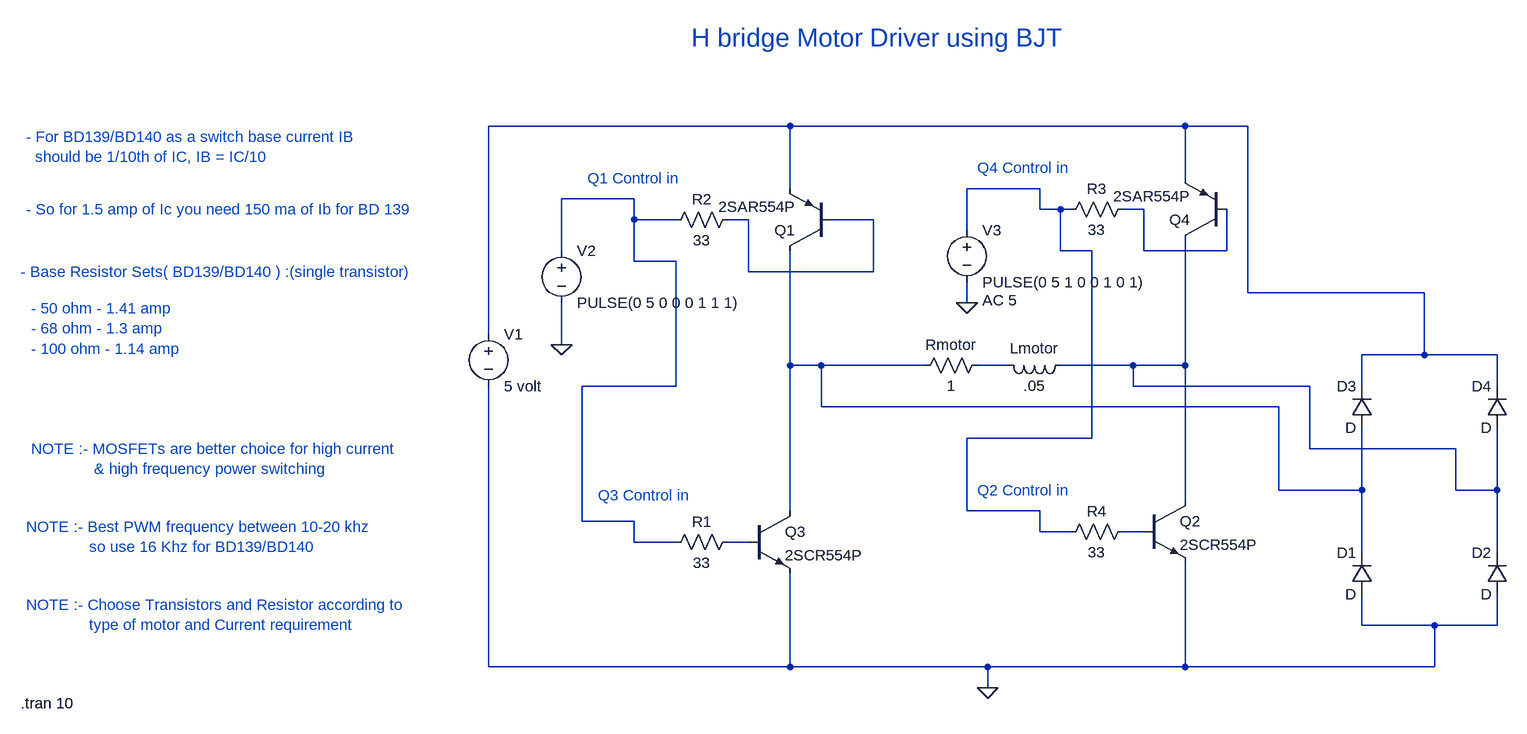
[diagram p0: schematic H Bridge using BJT.asc]
H Bridge using BJT.asc, the LTspice schematic file:
Version 4
SHEET 1 1668 840
WIRE 208 -64 -256 -64
WIRE 816 -64 208 -64
WIRE 912 -64 816 -64
WIRE 816 16 816 -64
WIRE 208 32 208 -64
WIRE 592 32 480 32
WIRE -32 48 -144 48
WIRE 592 64 592 32
WIRE 624 64 592 64
WIRE 640 64 624 64
WIRE 752 64 720 64
WIRE -32 80 -32 48
WIRE 32 80 -32 80
WIRE 144 80 112 80
WIRE 336 80 272 80
WIRE 480 96 480 32
WIRE -144 128 -144 48
WIRE 624 128 624 64
WIRE 672 128 624 128
WIRE 752 128 752 64
WIRE 880 128 880 64
WIRE 880 128 752 128
WIRE -32 144 -32 80
WIRE 32 144 -32 144
WIRE 144 160 144 80
WIRE 336 160 336 80
WIRE 336 160 144 160
WIRE 912 192 912 -64
WIRE 1184 192 912 192
WIRE 480 208 480 176
WIRE -256 256 -256 -64
WIRE -144 272 -144 208
WIRE 1184 288 1184 192
WIRE 1184 288 1088 288
WIRE 1296 288 1184 288
WIRE 208 304 208 128
WIRE 256 304 208 304
WIRE 416 304 256 304
WIRE 544 304 496 304
WIRE 736 304 624 304
WIRE 816 304 816 112
WIRE 816 304 736 304
WIRE 32 336 32 144
WIRE 32 336 -112 336
WIRE 736 336 736 304
WIRE 1008 336 736 336
WIRE 1088 336 1088 288
WIRE 1296 336 1296 288
WIRE 256 368 256 304
WIRE 960 368 256 368
WIRE 672 416 672 128
WIRE 672 416 480 416
WIRE 1008 432 1008 336
WIRE 1232 432 1008 432
WIRE 960 496 960 368
WIRE 1088 496 1088 400
WIRE 1088 496 960 496
WIRE 1232 496 1232 432
WIRE 1296 496 1296 400
WIRE 1296 496 1232 496
WIRE 816 512 816 304
WIRE 208 528 208 304
WIRE 480 528 480 416
WIRE 592 528 480 528
WIRE -112 544 -112 336
WIRE -32 544 -112 544
WIRE 592 560 592 528
WIRE 640 560 592 560
WIRE 752 560 720 560
WIRE -32 576 -32 544
WIRE 32 576 -32 576
WIRE 144 576 112 576
WIRE 1088 592 1088 496
WIRE 1296 592 1296 496
WIRE 1088 704 1088 656
WIRE 1200 704 1088 704
WIRE 1296 704 1296 656
WIRE 1296 704 1200 704
WIRE -256 768 -256 336
WIRE 208 768 208 624
WIRE 208 768 -256 768
WIRE 512 768 208 768
WIRE 816 768 816 608
WIRE 816 768 512 768
WIRE 1200 768 1200 704
WIRE 1200 768 816 768
WIRE 512 800 512 768
FLAG 512 800 0
FLAG -144 272 0
FLAG 480 208 0
SYMBOL npn 144 528 R0
SYMATTR InstName Q3
SYMATTR Value 2SCR554P
SYMBOL npn 752 512 R0
SYMATTR InstName Q2
SYMATTR Value 2SCR554P
SYMBOL res 512 288 R90
WINDOW 0 0 56 VBottom 2
WINDOW 3 32 56 VTop 2
SYMATTR InstName Rmotor
SYMATTR Value 1
SYMBOL ind 640 288 R90
WINDOW 0 5 56 VBottom 2
WINDOW 3 32 56 VTop 2
SYMATTR InstName Lmotor
SYMATTR Value .05
SYMBOL voltage -256 240 R0
WINDOW 123 0 0 Left 0
WINDOW 39 0 0 Left 0
SYMATTR InstName V1
SYMATTR Value 5 volt
SYMBOL pnp 880 112 R180
SYMATTR InstName Q4
SYMATTR Value 2SAR554P
SYMBOL pnp 272 128 R180
SYMATTR InstName Q1
SYMATTR Value 2SAR554P
SYMBOL res 128 560 R90
WINDOW 0 0 56 VBottom 2
WINDOW 3 32 56 VTop 2
SYMATTR InstName R1
SYMATTR Value 33
SYMBOL res 128 64 R90
WINDOW 0 0 56 VBottom 2
WINDOW 3 32 56 VTop 2
SYMATTR InstName R2
SYMATTR Value 33
SYMBOL res 736 48 R90
WINDOW 0 0 56 VBottom 2
WINDOW 3 32 56 VTop 2
SYMATTR InstName R3
SYMATTR Value 33
SYMBOL res 736 544 R90
WINDOW 0 0 56 VBottom 2
WINDOW 3 32 56 VTop 2
SYMATTR InstName R4
SYMATTR Value 33
SYMBOL diode 1104 656 R180
WINDOW 0 24 64 Left 2
WINDOW 3 24 0 Left 2
SYMATTR InstName D1
SYMBOL diode 1312 656 R180
WINDOW 0 24 64 Left 2
WINDOW 3 24 0 Left 2
SYMATTR InstName D2
SYMBOL diode 1104 400 R180
WINDOW 0 24 64 Left 2
WINDOW 3 24 0 Left 2
SYMATTR InstName D3
SYMBOL diode 1312 400 R180
WINDOW 0 24 64 Left 2
WINDOW 3 24 0 Left 2
SYMATTR InstName D4
SYMBOL voltage -144 112 R0
WINDOW 123 24 124 Left 2
WINDOW 39 0 0 Left 0
SYMATTR InstName V2
SYMATTR Value PULSE(0 5 0 0 0 1 1 1)
SYMBOL voltage 480 80 R0
WINDOW 123 24 124 Left 2
WINDOW 39 0 0 Left 0
SYMATTR Value2 AC 5
SYMATTR InstName V3
SYMATTR Value PULSE(0 5 1 0 0 1 0 1)
TEXT 56 -200 Left 4 ;H bridge Motor Driver using BJT
TEXT -968 672 Left 2 ;NOTE :- Choose Transistors and Resistor according to\n              type of motor and Current requirement
TEXT -104 16 Left 2 ;Q1 Control in
TEXT -88 504 Left 2 ;Q3 Control in
TEXT 496 0 Left 2 ;Q4 Control in
TEXT 496 496 Left 2 ;Q2 Control in
TEXT -968 552 Left 2 ;NOTE :- Best PWM frequency between 10-20 khz\n              so use 16 Khz for BD139/BD140
TEXT -968 -48 Left 2 ;- For BD139/BD140 as a switch base current IB\n  should be 1/10th of IC, IB = IC/10
TEXT -960 432 Left 2 ;NOTE :- MOSFETs are better choice for high current\n              & high frequency power switching
TEXT -976 160 Left 2 ;- Base Resistor Sets( BD139/BD140 ) :(single transistor)
TEXT -960 216 Left 2 ;- 50 ohm - 1.41 amp\n- 68 ohm - 1.3 amp\n- 100 ohm - 1.14 amp
TEXT -968 64 Left 2 ;- So for 1.5 amp of Ic you need 150 ma of Ib for BD 139
TEXT -976 824 Left 2 !.tran 10

The netlist it stands for:
* H Bridge using BJT.asc
Q3 N006 N010 0 0 2SCR554P
Q2 N008 N009 0 0 2SCR554P
Rmotor N007 N006 1
Lmotor N008 N007 .05
V1 N001 0 5 volt
Q4 N008 N004 N001 0 2SAR554P
Q1 N006 N005 N001 0 2SAR554P
R1 N010 N003 33
R2 N005 N003 33
R3 N004 N002 33
R4 N009 N002 33
D1 0 N006 D
D2 0 N008 D
D3 N006 N001 D
D4 N008 N001 D
V2 N003 0 PULSE(0 5 0 0 0 1 1 1)
V3 N002 0 PULSE(0 5 1 0 0 1 0 1) AC 5
.model D D
.lib standard.dio
.model NPN NPN
.model PNP PNP
.lib standard.bjt
* H bridge Motor Driver using BJT
* NOTE :- Choose Transistors and Resistor according to
*               type of motor and Current requirement
* Q1 Control in
* Q3 Control in
* Q4 Control in
* Q2 Control in
* NOTE :- Best PWM frequency between 10-20 khz
*               so use 16 Khz for BD139/BD140
* - For BD139/BD140 as a switch base current IB
*   should be 1/10th of IC, IB = IC/10
* NOTE :- MOSFETs are better choice for high current
*               & high frequency power switching
* - Base Resistor Sets( BD139/BD140 ) :(single transistor)
* - 50 ohm - 1.41 amp
* - 68 ohm - 1.3 amp
* - 100 ohm - 1.14 amp
* - So for 1.5 amp of Ic you need 150 ma of Ib for BD 139
.tran 10
.backanno
.end